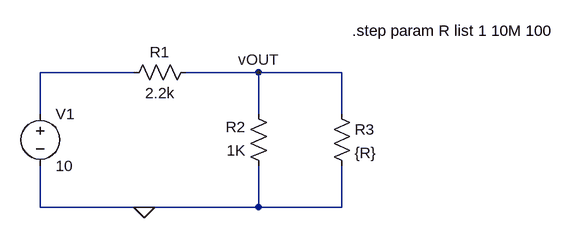
[diagram p0: schematic previoP2.asc]
previoP2.asc, the LTspice schematic file:
Version 4
SHEET 1 948 680
WIRE 256 64 112 64
WIRE 448 64 336 64
WIRE 576 64 448 64
WIRE 112 128 112 64
WIRE 448 128 448 64
WIRE 576 128 576 64
WIRE 112 272 112 208
WIRE 272 272 112 272
WIRE 448 272 448 208
WIRE 448 272 272 272
WIRE 576 272 576 208
WIRE 576 272 448 272
FLAG 272 272 0
FLAG 448 64 vOUT
SYMBOL voltage 112 112 R0
WINDOW 123 0 0 Left 2
WINDOW 39 0 0 Left 2
SYMATTR InstName V1
SYMATTR Value 10
SYMBOL res 352 48 R90
WINDOW 0 0 56 VBottom 2
WINDOW 3 32 56 VTop 2
SYMATTR InstName R1
SYMATTR Value 2.2k
SYMBOL res 464 224 R180
WINDOW 0 36 76 Left 2
WINDOW 3 36 40 Left 2
SYMATTR InstName R2
SYMATTR Value 1K
SYMBOL res 560 112 R0
SYMATTR InstName R3
SYMATTR Value {R}
TEXT 592 0 Left 2 !.step param R list 1 10M 100

The netlist it stands for:
* previoP2.asc
V1 N001 0 10
R1 vOUT N001 2.2k
R2 0 vOUT 1K
R3 vOUT 0 {R}
.step param R list 1 10M 100
.backanno
.end